# Altium schematic sheet PWR_DC_DC_EXAR.SchDoc: =ProjectName
size 420 x 297 mm; Author: T.P.; CompanyName: WUT; DrawnBy: T.P.; Organization: WUT ISE; Address1: Warsaw Univeristy of Technology; Address2: Nowowiejska 15/19; DocumentNumber: 27; Revision: 0.9; SheetNumber: 27; SheetTotal: 36; EDA_Number: ARTIQ; Projet: ARTIQ/SINARA; ModifiedBy: -; CreateDate: XX/XX/XXXX; CheckedDate: -; Title2: PWR_DC_DC_EXAR.SchDoc; DivGrp: ISE; Designer: G.K. and T.P.; ModifiedDate: -; ProjectName: ADC/DAC MEZZANINE
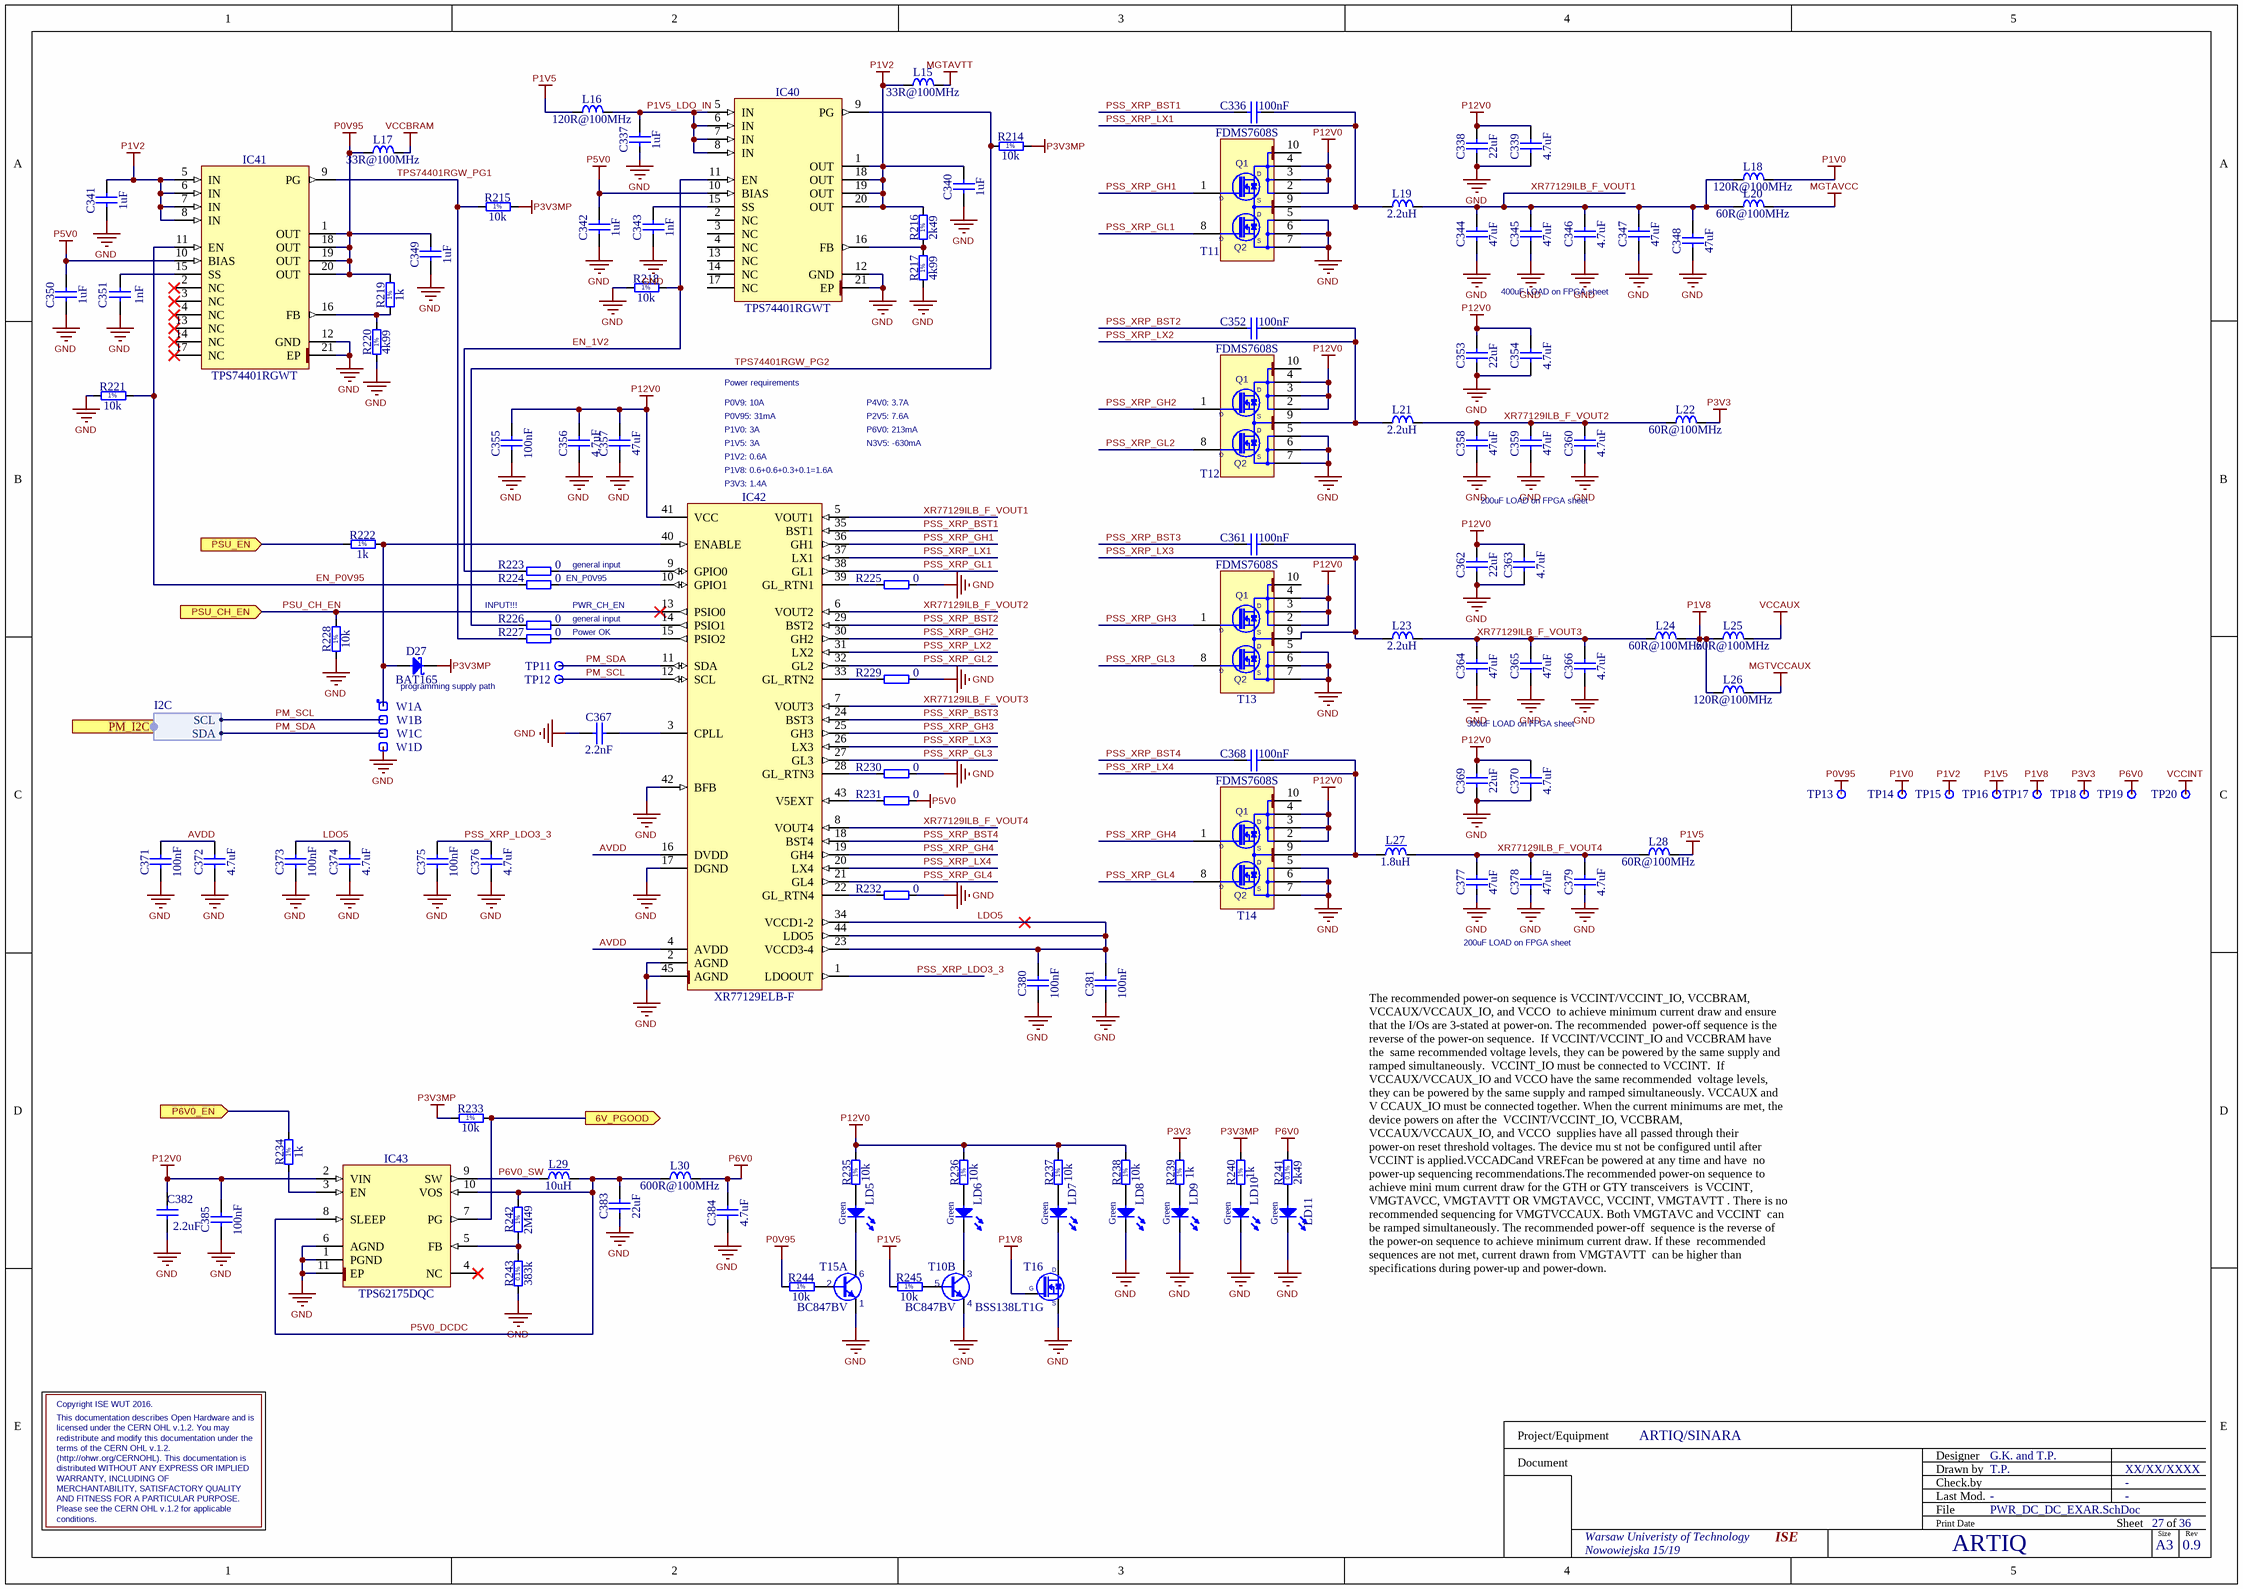
[diagram p0: PWR_DC_DC_EXAR.SchDoc]

## Parts
C336  100nF  [CAPC1005X55N]
C337  1uF  [CAPC1005X55N]
C338  22uF  [CAPC2012X135N]
C339  4.7uF  [CAPC1709X95N]
C340  1uF  [CAPC1005X55N]
C341  1uF  [CAPC1005X55N]
C342  1uF  [CAPC1005X55N]
C343  1nF  [CAPC1005X55N]
C344  47uF  [CAPC2012X140N]
C345  47uF  [CAPC2012X140N]
C346  4.7uF  [CAPC1709X95N]
C347  47uF  [CAPC2012X140N]
C348  47uF  [CAPC2012X140N]
C349  1uF  [CAPC1005X55N]
C350  1uF  [CAPC1005X55N]
C351  1nF  [CAPC1005X55N]
C352  100nF  [CAPC1005X55N]
C353  22uF  [CAPC2012X135N]
C354  4.7uF  [CAPC1709X95N]
C355  100nF  [CAPC1005X55N]
C356  4.7uF  [CAPC1709X95N]
C357  47uF  [CAPC3216X180N]
C358  47uF  [CAPC2012X140N]
C359  47uF  [CAPC2012X140N]
C360  4.7uF  [CAPC1709X95N]
C361  100nF  [CAPC1005X55N]
C362  22uF  [CAPC2012X135N]
C363  4.7uF  [CAPC1709X95N]
C364  47uF  [CAPC2012X140N]
C365  47uF  [CAPC2012X140N]
C366  4.7uF  [CAPC1709X95N]
C367  2.2nF  [CAPC1005X55N]
C368  100nF  [CAPC1005X55N]
C369  22uF  [CAPC2012X135N]
C370  4.7uF  [CAPC1709X95N]
C371  100nF  [CAPC1005X55N]
C372  4.7uF  [CAPC1709X95N]
C373  100nF  [CAPC1005X55N]
C374  4.7uF  [CAPC1709X95N]
C375  100nF  [CAPC1005X55N]
C376  4.7uF  [CAPC1709X95N]
C377  47uF  [CAPC2012X140N]
C378  47uF  [CAPC2012X140N]
C379  4.7uF  [CAPC1709X95N]
C380  100nF  [CAPC1005X55N]
C381  100nF  [CAPC1005X55N]
C382  2.2uF  [CAPC1005X55N]
C383  22uF  [CAPC2012X135N]
C384  4.7uF  [CAPC1709X95N]
C385  100nF  [CAPC1005X55N]
D27  BAT165  [SOD2512X110N]
IC40  TPS74401RGWT  [QFN65P500X500X100-21N-S325]
IC41  TPS74401RGWT  [QFN65P500X500X100-21N-S325]
IC42  XR77129ELB-F  [QFN50P700X700X80-45N-S520]
IC43  TPS62175DQC  [SON50P200X300X80-11N-R94X250]
L15  33R@100MHz  [INDC1608X95N]
L16  120R@100MHz  [INDC1608X95N]
L17  33R@100MHz  [INDC1608X95N]
L18  120R@100MHz  [INDC1608X95N]
L19  2.2uH  [IND_BOURNS_SRP6540]
L20  60R@100MHz  [INDC4516X180N]
L21  2.2uH  [IND_BOURNS_SRP6540]
L22  60R@100MHz  [INDC4516X180N]
L23  2.2uH  [IND_BOURNS_SRP6540]
L24  60R@100MHz  [INDC4516X180N]
L25  60R@100MHz  [INDC4516X180N]
L26  120R@100MHz  [INDC1608X95N]
L27  1.8uH  [IND_COILCRAFT_XAL7070]
L28  60R@100MHz  [INDC4516X180N]
L29  10uH  [IND_WURTH_WE-SPC-4838]
L30  600R@100MHz  [INDC2012X110N]
LD5  Green  [LED_OSRAM_LGL29K]
LD6  Green  [LED_OSRAM_LGL29K]
LD7  Green  [LED_OSRAM_LGL29K]
LD8  Green  [LED_OSRAM_LGL29K]
LD9  Green  [LED_OSRAM_LGL29K]
LD10  Green  [LED_OSRAM_LGL29K]
LD11  Green  [LED_OSRAM_LGL29K]
R214  10k  [RESC1005X40N]
R215  10k  [RESC1005X40N]
R216  2k49  [RESC1608X55N]
R217  4k99  [RESC1608X55N]
R218  10k  [RESC1005X40N]
R219  1k  [RESC1005X40N]
R220  4k99  [RESC1608X55N]
R221  10k  [RESC1005X40N]
R222  1k  [RESC1005X40N]
R223  0  [RESC1005X40N]
R224  0  [RESC1005X40N]
R225  0  [RESC1005X40N]
R226  0  [RESC1005X40N]
R227  0  [RESC1005X40N]
R228  10k  [RESC1005X40N]
R229  0  [RESC1005X40N]
R230  0  [RESC1005X40N]
R231  0  [RESC1005X40N]
R232  0  [RESC1005X40N]
R233  10k  [RESC1005X40N]
R234  1k  [RESC1005X40N]
R235  10k  [RESC1005X40N]
R236  10k  [RESC1005X40N]
R237  10k  [RESC1005X40N]
R238  10k  [RESC1005X40N]
R239  1k  [RESC1005X40N]
R240  1k  [RESC1005X40N]
R241  2k49  [RESC1608X55N]
R242  2M49  [RESC1608X55N]
R243  383k  [RESC1608X55N]
R244  10k  [RESC1005X40N]
R245  10k  [RESC1005X40N]
T10  BC847BV  [SOTFL50P160X60-6N]  (part B of 2)
T11  FDMS7608S  [FAIRCHILD_MLP08P]
T12  FDMS7608S  [FAIRCHILD_MLP08P]
T13  FDMS7608S  [FAIRCHILD_MLP08P]
T14  FDMS7608S  [FAIRCHILD_MLP08P]
T15  BC847BV  [SOTFL50P160X60-6N]  (part A of 2)
T16  BSS138LT1G  [SOT95P240X110-3N]
TP11  Test Point  [TPS127]  (value not drawn)
TP12  Test Point  [TPS127]  (value not drawn)
TP13  Test Point  [TPS127]  (value not drawn)
TP14  Test Point  [TPS127]  (value not drawn)
TP15  Test Point  [TPS127]  (value not drawn)
TP16  Test Point  [TPS127]  (value not drawn)
TP17  Test Point  [TPS127]  (value not drawn)
TP18  Test Point  [TPS127]  (value not drawn)
TP19  Test Point  [TPS127]  (value not drawn)
TP20  Test Point  [TPS127]  (value not drawn)
W1  Header 4  [SAMTEC_MTLW-104-07-L-S-250]  (value not drawn)  (parts A,B,C,D of 4)

## Ports
6V_PGOOD (out), P6V0_EN (in), PM_I2C (harness I2C), PSU_CH_EN (in), PSU_EN (in)

## Harnesses
I2C: SCL, SDA

## Nets
GND: C337.1 C338.1 C339.1 C340.1 C341.1 C342.1 C343.1 C344.1 C345.1 C346.1 C347.1 C348.1 C349.1 C350.1 C351.2 C353.1 C354.1 C355.1 C356.1 C357.1 C358.1 C359.1 C360.1 C362.1 C363.1 C364.1 C365.1 C366.1 C367.1 C369.1 C370.1 C371.1 C372.1 C373.1 C374.1 C375.1 C376.1 C377.1 C378.1 C379.1 C380.1 C381.1 C382.1 C383.1 C384.1 C385.1 IC40.12(GND) IC40.21(EP) IC41.12(GND) IC41.21(EP) IC42.2(AGND) IC42.17(DGND) IC42.42(BFB) IC42.45(AGND) IC43.1(PGND) IC43.6(AGND) IC43.11(EP) LD8.1(C) LD9.1(C) LD10.1(C) LD11.1(C) R217.1 R218.1 R220.1 R221.1 R225.2 R228.1 R229.2 R230.2 R232.2 R243.1 T10.4(E) T11.5(S2) T11.6(S2) T11.7(S2) T12.5(S2) T12.6(S2) T12.7(S2) T13.5(S2) T13.6(S2) T13.7(S2) T14.5(S2) T14.6(S2) T14.7(S2) T15.1(E) T16.2(S) W1.4
MGTAVCC: L20.2
MGTAVTT: L15.2
MGTVCCAUX: L26.1
P0V95: C349.2 IC41.1(OUT) IC41.18(OUT) IC41.19(OUT) IC41.20(OUT) L17.1 R219.2 R244.1 TP13.1
P1V0: L18.1 TP14.1
P1V2: C340.2 C341.2 IC40.1(OUT) IC40.18(OUT) IC40.19(OUT) IC40.20(OUT) IC41.5(IN) IC41.6(IN) IC41.7(IN) IC41.8(IN) L15.1 R216.2 TP15.1
P1V5: L16.2 L28.2 R245.1 TP16.1
P1V8: L24.2 L25.1 L26.2 T16.1(G) TP17.1
P3V3: L22.2 R239.2 TP18.1
P3V3MP: D27.1(C) R214.2 R215.2 R233.1 R240.2
P5V0: C342.2 C350.2 IC40.10(BIAS) IC41.10(BIAS) R231.2
P6V0: C384.2 L30.2 R241.2 TP19.1
P12V0: C338.2 C339.2 C353.2 C354.2 C355.2 C356.2 C357.2 C362.2 C363.2 C369.2 C370.2 C382.2 C385.2 IC42.41(VCC) IC43.2(VIN) R235.2 R236.2 R237.2 R238.2 T11.2(D1) T11.3(D1) T11.4(D1) T12.2(D1) T12.3(D1) T12.4(D1) T13.2(D1) T13.3(D1) T13.4(D1) T14.2(D1) T14.3(D1) T14.4(D1)
VCCAUX: L25.2
VCCBRAM: L17.2
VCCINT: TP20.1
6V_PGOOD: IC43.7(PG) R233.2 ; port 6V_PGOOD
AVDD: C371.2 C372.2 IC42.4(AVDD) IC42.16(DVDD)
EN_1V2: IC40.11(EN) R218.2 R223.1
EN_P0V95: IC41.11(EN) R221.2 R224.1
LDO5: C373.2 C374.2 C380.2 C381.2 IC42.23(VCCD3-4) IC42.34(VCCD1-2) IC42.44(LDO5)
P1V5_LDO_IN: C337.2 IC40.5(IN) IC40.6(IN) IC40.7(IN) IC40.8(IN) L16.1
P5V0_DCDC: C383.2 IC43.8(SLEEP) IC43.10(VOS) L29.2 L30.1 R242.2
P6V0_EN: R234.2 ; port P6V0_EN
P6V0_SW: IC43.9(SW) L29.1
PM_SCL: IC42.12(SCL) TP12.1 W1.2 ; port PM_I2C.SCL
PM_SDA: IC42.11(SDA) TP11.1 W1.3 ; port PM_I2C.SDA
PSS_XRP_BST1: C336.2 IC42.35(BST1)
PSS_XRP_BST2: C352.2 IC42.29(BST2)
PSS_XRP_BST3: C361.2 IC42.24(BST3)
PSS_XRP_BST4: C368.2 IC42.18(BST4)
PSS_XRP_GH1: IC42.36(GH1) T11.1(G1)
PSS_XRP_GH2: IC42.30(GH2) T12.1(G1)
PSS_XRP_GH3: IC42.25(GH3) T13.1(G1)
PSS_XRP_GH4: IC42.19(GH4) T14.1(G1)
PSS_XRP_GL1: IC42.38(GL1) T11.8(G2)
PSS_XRP_GL2: IC42.32(GL2) T12.8(G2)
PSS_XRP_GL3: IC42.27(GL3) T13.8(G2)
PSS_XRP_GL4: IC42.21(GL4) T14.8(G2)
PSS_XRP_LDO3_3: C375.2 C376.2 IC42.1(LDOOUT)
PSS_XRP_LX1: C336.1 IC42.37(LX1) L19.1 T11.9(S1D2)
PSS_XRP_LX2: C352.1 IC42.31(LX2) L21.1 T12.9(S1D2)
PSS_XRP_LX3: C361.1 IC42.26(LX3) L23.1 T13.9(S1D2)
PSS_XRP_LX4: C368.1 IC42.20(LX4) L27.1 T14.9(S1D2)
PSU_CH_EN: IC42.13(PSIO0) R228.2 ; port PSU_CH_EN
PSU_EN: R222.2 ; port PSU_EN
TPS74401RGW_PG1: IC41.9(PG) R215.1 R227.1
TPS74401RGW_PG2: IC40.9(PG) R214.1 R226.1
XR77129ILB_F_VOUT1: C344.2 C345.2 C346.2 C347.2 C348.2 IC42.5(VOUT1) L18.2 L19.2 L20.1
XR77129ILB_F_VOUT2: C358.2 C359.2 C360.2 IC42.6(VOUT2) L21.2 L22.1
XR77129ILB_F_VOUT3: C364.2 C365.2 C366.2 IC42.7(VOUT3) L23.2 L24.1
XR77129ILB_F_VOUT4: C377.2 C378.2 C379.2 IC42.8(VOUT4) L27.2 L28.1
NetC343_2: C343.2 IC40.15(SS)
NetC351_1: C351.1 IC41.15(SS)
NetC367_2: C367.2 IC42.3(CPLL)
NetD27_2: D27.2(A) IC42.40(ENABLE) R222.1 W1.1
NetIC40_16: IC40.16(FB) R216.1 R217.2
NetIC41_16: IC41.16(FB) R219.1 R220.2
NetIC42_9: IC42.9(GPIO0) R223.2
NetIC42_10: IC42.10(GPIO1) R224.2
NetIC42_14: IC42.14(PSIO1) R226.2
NetIC42_15: IC42.15(PSIO2) R227.2
NetIC42_22: IC42.22(GL_RTN4) R232.1
NetIC42_28: IC42.28(GL_RTN3) R230.1
NetIC42_33: IC42.33(GL_RTN2) R229.1
NetIC42_39: IC42.39(GL_RTN1) R225.1
NetIC42_43: IC42.43(V5EXT) R231.1
NetIC43_3: IC43.3(EN) R234.1
NetIC43_5: IC43.5(FB) R242.1 R243.2
NetLD5_1: LD5.1(C) T15.6(C)
NetLD5_2: LD5.2(A) R235.1
NetLD6_1: LD6.1(C) T10.3(C)
NetLD6_2: LD6.2(A) R236.1
NetLD7_1: LD7.1(C) T16.3(D)
NetLD7_2: LD7.2(A) R237.1
NetLD8_2: LD8.2(A) R238.1
NetLD9_2: LD9.2(A) R239.1
NetLD10_2: LD10.2(A) R240.1
NetLD11_2: LD11.2(A) R241.1
NetR244_2: R244.2 T15.2(B)
NetR245_2: R245.2 T10.5(B)

Not connected (* = marked no-connect by the designer): IC40 2(NC) 3(NC) 4(NC) 13(NC) 14(NC) 17(NC); IC41 2(NC)* 3(NC)* 4(NC)* 13(NC)* 14(NC)* 17(NC)*; IC43 4(NC)*; T11 10(D1); T12 10(D1); T13 10(D1); T14 10(D1)

## Notes on the sheet
- 400uF LOAD on FPGA sheet
- Power requirements
- P1V0: 3A
- P0V95: 31mA
- P1V5: 3A
- P0V9: 10A
- P1V2: 0.6A
- P4V0: 3.7A
- P2V5: 7.6A
- P6V0: 213mA
- N3V5: -630mA
- (near IC42) P3V3: 1.4A
- (near IC42) P1V8: 0.6+0.6+0.3+0.1=1.6A
- 200uF LOAD on FPGA sheet
- EN_P0V95
- general input
- INPUT!!!
- Power OK
- PWR_CH_EN
- programming supply path
- 300uF LOAD on FPGA sheet
- The recommended power-on sequence is VCCINT/VCCINT_IO, VCCBRAM, VCCAUX/VCCAUX_IO, and VCCO  to achieve minimum current draw and ensure that the I/Os are 3-stated at power-on. The recommended  power-off sequence is the reverse of the power-on sequence.  If VCCINT/VCCINT_IO and VCCBRAM have the  same recommended voltage levels, they can be powered by the same supply and ramped simultaneously.  VCCINT_IO must be connected to VCCINT.  If VCCAUX/VCCAUX_IO and VCCO have the same recommended  voltage levels, they can be powered by the same supply and ramped simultaneously. VCCAUX and V CCAUX_IO must be connected together. When the current minimums are met, the device powers on after the  VCCINT/VCCINT_IO, VCCBRAM, VCCAUX/VCCAUX_IO, and VCCO  supplies have all passed through their power-on reset threshold voltages. The device mu st not be configured until after VCCINT is applied.VCCADCand VREFcan be powered at any time and have  no power-up sequencing recommendations.The recommended power-on sequence to achieve mini mum current draw for the GTH or GTY transceivers  is VCCINT, VMGTAVCC, VMGTAVTT OR VMGTAVCC, VCCINT, VMGTAVTT . There is no recommended sequencing for VMGTVCCAUX. Both VMGTAVC and VCCINT  can be ramped simultaneously. The recommended power-off  sequence is the reverse of the power-on sequence to achieve minimum current draw. If these  recommended sequences are not met, current drawn from VMGTAVTT  can be higher than specifications during power-up and power-down.
- This documentation describes Open Hardware and is
- Copyright ISE WUT 2016.
- redistribute and modify this documentation under the
- terms of the CERN OHL v.1.2.
- distributed WITHOUT ANY EXPRESS OR IMPLIED
- licensed under the CERN OHL v.1.2. You may
- MERCHANTABILITY, SATISFACTORY QUALITY
- (http://ohwr.org/CERNOHL). This documentation is
- WARRANTY, INCLUDING OF
- Please see the CERN OHL v.1.2 for applicable
- conditions.
- AND FITNESS FOR A PARTICULAR PURPOSE.
- Project/Equipment
- Document
- Designer
- Drawn by
- Check.by
- File
- Last Mod.
- Print Date
- Sheet
- Size
- A3
- of
- Rev
- (in symbol FDMS7608S) D; Q1; G; S; Q2
- (in symbol R0402_1K_1%_0.0625W_100PPM) 1%
- (in symbol R0402_10K_1%_0.0625W_100PPM) 1%
- (in symbol R0603_2K49_0.1%_0.063W_10PPM) 0.1%
- (in symbol R0603_2K49_1%_0.063W_50PPM) 1%
- (in symbol R0603_2M49_1%_0.1W_100PPM) 1%
- (in symbol R0603_4K99_1%_0.063W_50PPM) 1%
- (in symbol R0603_383K_0.1%_0.063W_25PPM) 0.1%

## Library data of the parts
C336 C352 C355 C361 C368 C371 C373 C375 C380 C381 C385 = CC0402_100NF_16V_10%_X5R: Non-polarised capacitor; Manufacturer: GENERIC; Part Description: SMD Multilayer Chip Ceramic Capacitor; Manufacturer1 Part Number: GRM155R61C104KA88D; Tolerance: ±10%; Voltage: 16V; TC: X5R; Manufacturer Part Number: CC0402_100NF_16V_10%_X5R; Part Number: CC0402_100NF_16V_10%_X5R; Value: 100nF; Component Kind: Standard; Component Type: Standard; Pin Count: 2; Status: None; Case: 0402; Mounted: Yes; Socket: No; SMD: Yes; Sense: No; Manufacturer1 Example: MURATA; Manufacturer1 ComponentHeight: 0.55mm; HelpURL: \\cern.ch\dfs\Applications\Altium\Datasheets\CC0402_X5R_MURATA_GRM.pdf; Author: CERN DEM JLC; CreateDate: 10.12.2013; LatestRevisionDate: 10.12.2013
C337 C340-C342 C349 C350 = CC0402_1UF_16V_10%_X5R: Non-polarised capacitor; Manufacturer: GENERIC; Part Description: SMD Multilayer Chip Ceramic Capacitor; Manufacturer1 Part Number: C1005X5R1C105KT; Tolerance: ±10%; Voltage: 16V; TC: X5R; Manufacturer Part Number: CC0402_1UF_16V_10%_X5R; Part Number: CC0402_1UF_16V_10%_X5R; Value: 1uF; Component Kind: Standard; Component Type: Standard; Pin Count: 2; Status: Preferred; Case: 0402; Mounted: Yes; Socket: No; SMD: Yes; Sense: No; Manufacturer1 Example: TDK; Manufacturer1 ComponentHeight: 0.55mm; HelpURL: \\cern.ch\dfs\Applications\Altium\Datasheets\CC0402_X5R_TDK_C.pdf; Author: CERN DEM JLC; CreateDate: 25.10.2012; LatestRevisionDate: 25.10.2012
C338 C353 C362 C369 C383 = CC0805_22UF_16V_10%_X5R: Non-polarised capacitor; Manufacturer: GENERIC; Part Description: SMD Multilayer Chip Ceramic Capacitor; Manufacturer1 Part Number: C2012X5R1C226KT; Tolerance: ±10%; Voltage: 16V; TC: X5R; Manufacturer Part Number: CC0805_22UF_16V_10%_X5R; Part Number: CC0805_22UF_16V_10%_X5R; Value: 22uF; Component Kind: Standard; Component Type: Standard; Pin Count: 2; Status: Preferred; Case: 0805; Mounted: Yes; Socket: No; SMD: Yes; Sense: No; Manufacturer1 Example: TDK; Manufacturer1 ComponentHeight: 1.35mm; HelpURL: \\cern.ch\dfs\Applications\Altium\Datasheets\CC0805_X5R_TDK_C.pdf; Author: CERN DEM JLC; CreateDate: 25.10.2012; LatestRevisionDate: 25.10.2012
C339 C346 C354 C356 C360 C363 C366 C370 C372 C374 C376 C379 C384 = CC0603_4.7UF_16V_10%_X5R: Non-polarised capacitor; Manufacturer: GENERIC; Part Description: SMD Multilayer Chip Ceramic Capacitor; Manufacturer1 Part Number: EMK107ABJ475KA-T; Tolerance: ±10%; Voltage: 16V; TC: X5R; Manufacturer Part Number: CC0603_4.7UF_16V_10%_X5R; Part Number: CC0603_4.7UF_16V_10%_X5R; Value: 4.7uF; Component Kind: Standard; Component Type: Standard; Pin Count: 2; Status: None; Case: 0603; Mounted: Yes; Socket: No; SMD: Yes; Sense: No; Manufacturer1 Example: TAIYO YUDEN; Manufacturer1 ComponentHeight: 0.95mm; HelpURL: \\cern.ch\dfs\Applications\Altium\Datasheets\CC0603_X7R_TAIYO-YUDEN_HIGH-VALUE.pdf; Author: CERN DEM JLC; CreateDate: 16.12.2013; LatestRevisionDate: 16.09.2014
C343 C351 = CC0402_1NF_50V_10%_X7R: Non-polarised capacitor; Manufacturer: GENERIC; Manufacturer1 Part Number: 223858715623; Part Description: SMD Multilayer Chip Ceramic Capacitor; TC: X7R; Tolerance: ±10%; Voltage: 50V; Author: CERN DEM JLC; Case: 0402; Component Kind: Standard; Component Type: Standard; CreateDate: 03.12.2007; HelpURL: \\cern.ch\dfs\Applications\Altium\Datasheets\CC0402_X7R_PHYCOMP.pdf; LatestRevisionDate: 03.12.2007; Manufacturer Part Number: CC0402_1NF_50V_10%_X7R; Manufacturer1 ComponentHeight: 0.55mm; Manufacturer1 Example: PHYCOMP; Mounted: Yes; Part Number: CC0402_1NF_50V_10%_X7R; Pin Count: 2; SMD: Yes; Socket: No; Status: Not Recommended; Value: 1nF; Sense: No
C344 C345 C347 C348 C358 C359 C364 C365 C377 C378 = CC0805_47UF_6.3V_20%_X5R: Non-polarised capacitor; Manufacturer: GENERIC; Part Description: SMD Multilayer Chip Ceramic Capacitor; Manufacturer1 Part Number: C0805C476M9PACTU; Tolerance: ±20%; Voltage: 6.3V; TC: X5R; Manufacturer Part Number: CC0805_47UF_6.3V_20%_X5R; Part Number: CC0805_47UF_6.3V_20%_X5R; Value: 47uF; Component Kind: Standard; Component Type: Standard; Pin Count: 2; Status: Preferred; Case: 0805; Mounted: Yes; Socket: No; SMD: Yes; Sense: No; Manufacturer1 Example: KEMET; Manufacturer1 ComponentHeight: 1.4mm; HelpURL: \\cern.ch\dfs\Applications\Altium\Datasheets\CC0805_X5R_KEMET.pdf; Author: CERN DEM JLC; CreateDate: 16.10.2012; LatestRevisionDate: 16.10.2012
C357 = CC1206_47UF_25V_20%_X5R: Non-polarised capacitor; Manufacturer: GENERIC; Part Description: SMD Multilayer Chip Ceramic Capacitor; Manufacturer1 Part Number: C3216X5R1E476M160AC; Tolerance: ±20%; Voltage: 25V; TC: X5R; Manufacturer Part Number: CC1206_47UF_25V_20%_X5R; Part Number: CC1206_47UF_25V_20%_X5R; Value: 47uF; Component Kind: Standard; Component Type: Standard; Pin Count: 2; Status: None; Case: 1206; Mounted: Yes; Socket: No; SMD: Yes; Sense: No; Manufacturer1 Example: TDK; Manufacturer1 ComponentHeight: 1.8mm; HelpURL: \\cern.ch\dfs\Applications\Altium\Datasheets\CC1206_X5R_TDK_C.pdf; Author: CERN DEM JLC; CreateDate: 20.11.2013; LatestRevisionDate: 14.03.2017
C367 = CC0402_2.2NF_50V_10%_X7R: Non-polarised capacitor; Manufacturer: GENERIC; Part Description: SMD Multilayer Chip Ceramic Capacitor; Manufacturer1 Part Number: 223858715627; Tolerance: ±10%; Voltage: 50V; TC: X7R; Manufacturer Part Number: CC0402_2.2NF_50V_10%_X7R; Part Number: CC0402_2.2NF_50V_10%_X7R; Value: 2.2nF; Component Kind: Standard; Component Type: Standard; Pin Count: 2; Status: Not Recommended; Case: 0402; Mounted: Yes; Socket: No; SMD: Yes; Sense: No; Manufacturer1 Example: PHYCOMP; Manufacturer1 ComponentHeight: 0.55mm; HelpURL: \\cern.ch\dfs\Applications\Altium\Datasheets\CC0402_X7R_PHYCOMP.pdf; Author: CERN DEM JLC; CreateDate: 03.12.2007; LatestRevisionDate: 03.12.2007
C382 = CC0402_2.2UF_6.3V_10%_X5R: Non-polarised capacitor; Part Description: SMD Multilayer Chip Ceramic Capacitor; Manufacturer: GENERIC; Manufacturer1 Part Number: C1005X5R0J225K050BC; Voltage: 6.3V; TC: X5R; Tolerance: ±10%; Part Number: CC0402_2.2UF_6.3V_10%_X5R; Component Kind: Standard; Component Type: Standard; Pin Count: 2; Value: 2.2uF; Status: Preferred; Manufacturer Part Number: CC0402_2.2UF_6.3V_10%_X5R; Case: 0402; Mounted: Yes; Socket: No; SMD: Yes; Sense: No; Manufacturer1 Example: TDK; Manufacturer1 ComponentHeight: 0.55mm; HelpURL: \\cern.ch\dfs\Applications\Altium\Datasheets\CC0402_X5R_TDK_C.pdf; Author: CERN DEM JMW; CreateDate: 22.09.2015; LatestRevisionDate: 22.09.2015
D27 = BAT165: Schottky Diode; Manufacturer: INFINEON; Part Description: Medium Power AF Schottky Diode; Voltage: 40V; Power: 750mA; PressFit: No; Bonding: No; Manufacturer Part Number: BAT165; PackageDescription: Small Outline Diode (SOD-323), 1.70mm W X 1.25mm L X 1.10mm H body,  IPC Medium Density; Part Number: BAT165; Component Kind: Standard; Component Type: Standard; Device: BAT165; Pin Count: 2; Case: SOD323; Mounted: Yes; Socket: No; SMD: Yes; Sense: No; ComponentHeight: 1.1mm; HelpURL: \\cern.ch\dfs\Applications\Altium\Datasheets\BAT165.pdf; Author: CERN DEM JLC; CreateDate: 12.11.2014; LatestRevisionDate: 12.11.2014
IC40 IC41 = TPS74401RGWT: Single Output LDO, 3.0A, Adj.(0.8 to 3.3V), Fast Transient Response, Programmable SoftStart; Manufacturer: TEXAS INSTRUMENTS; PressFit: No; Bonding: No; Manufacturer Part Number: TPS74401RGWT; PackageDescription: QFN, 0.65mm pitch,square; 20 pin, 5mm X 5mm X 1mm H body (w/thermal tab 3.25 X 3.25mm),  IPC Medium Density; Part Description: Single Output LDO, 3.0A, Adj.(0.8 to 3.3V), Fast Transient Response, Programmable SoftStart; Part Number: TPS74401RGWT; Component Kind: Standard; Component Type: Standard; Device: TPS74401RGWT; Pin Count: 21; Case: QFN20; Mounted: Yes; Socket: No; SMD: Yes; Sense: No; ComponentHeight: 1mm; HelpURL: \\cern.ch\dfs\Applications\Altium\Datasheets\TPS74401RGWT.pdf; Author: CERN DEM JLC; CreateDate: 02.02.2010; LatestRevisionDate: 02.02.2010
IC42 = XR77129ELB-F: 40V Quad Channel Digital PWM/PFM Universal PMIC; Manufacturer: EXAR; PressFit: No; Bonding: No; Manufacturer Part Number: XR77129ELB-F; Part Description: 40V Quad Channel Digital PWM/PFM Universal PMIC; Part Number: XR77129ELB-F; Component Kind: Standard; Component Type: Standard; Device: XR77129ELB-F; PackageDescription: 50mm Pitch, Square; 44 Pin, 7.00mm L X 7.00mm W X 0.80mm H Body (W/Thermal Tab 5.2mm X 5.2mm), IPC Medium Density; Pin Count: 45; Case: QFN44; Mounted: Yes; Socket: No; SMD: Yes; Sense: No; ComponentHeight: 0.8mm; HelpURL: \\cern.ch\dfs\Applications\Altium\Datasheets\XR77129ELB-F.pdf; Author: CERN DEM JLC; CreateDate: 04.07.2017; LatestRevisionDate: 04.07.2017
IC43 = TPS62175DQC: 4.75-28VDC to 1-6VDC, 500mA Step-Down Converter With Sleep Mode; Manufacturer: TEXAS INSTRUMENTS; PressFit: No; Bonding: No; Manufacturer Part Number: TPS62175DQC; PackageDescription: SON, 10-Leads, Body 2x3mm, Pitch 0.5mm, Thermal Pad 0.94x2.5mm, IPC Medium Density; Part Description: 4.75-28VDC to 1-6VDC, 500mA Step-Down Converter With Sleep Mode; Part Number: TPS62175DQC; Component Kind: Standard; Component Type: Standard; Device: TPS62175DQC; Pin Count: 11; Case: SON10; Mounted: Yes; Socket: No; SMD: Yes; Sense: No; ComponentHeight: 0.8mm; HelpURL: \\cern.ch\dfs\Applications\Altium\Datasheets\TPS62175DQC.pdf; Author: CERN DEM JMW; CreateDate: 11.08.2015; LatestRevisionDate: 11.08.2015
L15 L17 = IND0603_MURATA_BLM18PG330SN1D: Inductor; Manufacturer: MURATA; Part Description: SMD EMIFIL Chip Ferrite Bead; Tolerance: ±25%; Power: 3A; Resistance: 0.025R; Manufacturer Part Number: BLM18PG330SN1D; Part Number: IND0603_MURATA_BLM18PG330SN1D; Value: 33R@100MHz; Component Kind: Standard; Component Type: Standard; Pin Count: 2; Status: None; Case: 0603; Mounted: Yes; Socket: No; SMD: Yes; Sense: No; ComponentHeight: 0.95mm; HelpURL: \\cern.ch\dfs\Applications\Altium\Datasheets\IND0603_MURATA_BLM18P.pdf; Author: CERN DEM JMW; CreateDate: 19.02.2014; LatestRevisionDate: 19.02.2014
L16 L18 L26 = IND0603_MURATA_BLM18PG121SN1D: Inductor; Manufacturer: MURATA; Part Description: SMD EMIFIL Chip Ferrite Bead; Power: 2A; Resistance: 0.05R; Manufacturer Part Number: BLM18PG121SN1D; Part Number: IND0603_MURATA_BLM18PG121SN1D; Value: 120R@100MHz; Component Kind: Standard; Component Type: Standard; Pin Count: 2; Status: None; Case: 0603; Mounted: Yes; Socket: No; SMD: Yes; Sense: No; ComponentHeight: 0.95mm; HelpURL: \\cern.ch\dfs\Applications\Altium\Datasheets\IND0603_MURATA_BLM18P.pdf; Author: CERN DEM BC; CreateDate: 27.07.2015; LatestRevisionDate: 27.07.2015
L19 L21 L23 = IND_2.2UH_20%_BOURNS_SRP6540: Inductor; Manufacturer Part Number: SRP6540-2R2M; Manufacturer: BOURNS; Part Description: Shielded SMD Power Inductor; Tolerance: ±20%; Power: 9A; Resistance: 0.0155R; Part Number: IND_2.2UH_20%_BOURNS_SRP6540; Value: 2.2uH; Component Kind: Standard; Component Type: Standard; Pin Count: 2; Status: None; Mounted: Yes; Socket: No; SMD: Yes; Sense: No; ComponentHeight: 4mm; HelpURL: \\cern.ch\dfs\Applications\Altium\Datasheets\IND_BOURNS_SRP6540.pdf; Author: CERN DEM JMW; CreateDate: 06.08.2015; LatestRevisionDate: 06.08.2015
L20 L22 L24 L25 L28 = IND1806_MURATA_BLM41PG600SN1L: Inductor; Manufacturer: MURATA; Part Description: SMD EMI Suppression Chip Ferrite Bead (BLM41P Series); Power: 6A; Resistance: 0.01R; Manufacturer Part Number: BLM41PG600SN1L; Part Number: IND1806_MURATA_BLM41PG600SN1L; Value: 60R@100MHz; Component Kind: Standard; Component Type: Standard; Pin Count: 2; Status: None; Case: 1806; Mounted: Yes; Socket: No; SMD: Yes; Sense: No; ComponentHeight: 1.8mm; HelpURL: \\cern.ch\dfs\Applications\Altium\Datasheets\IND1806_MURATA_BLM41P.pdf; Author: CERN DEM JLC; CreateDate: 02.12.2009; LatestRevisionDate: 02.12.2009
L27 = IND_1.8UH_20%_COILCRAFT_XAL7070: Inductor With Core; Manufacturer Part Number: XAL7070-182MEC; Part Description: SMD Shielded Power Inductor; Tolerance: ±20%; Power: 15.8A; Resistance: 0.00405R; Manufacturer: COILCRAFT; Part Number: IND_1.8UH_20%_COILCRAFT_XAL7070; Value: 1.8uH; Component Kind: Standard; Component Type: Standard; Pin Count: 2; Status: None; Mounted: Yes; Socket: No; SMD: Yes; Sense: No; ComponentHeight: 7mm; HelpURL: \\cern.ch\dfs\Applications\Altium\Datasheets\IND_COILCRAFT_XAL7070.pdf; Author: CERN DEM JLC; CreateDate: 03.11.2016; LatestRevisionDate: 03.11.2016
L29 = IND_10UH_20%_WURTH_WE-SPC_74408943100: Inductor With Core; Part Description: SMD Shielded Power Inductor (WE-SPC Series); Manufacturer: WURTH ELEKTRONIK; Power: 1.65A; Resistance: 0.082R; Tolerance: ±20%; Part Number: IND_10UH_20%_WURTH_WE-SPC_74408943100; Component Kind: Standard; Component Type: Standard; Pin Count: 2; Value: 10uH; Status: None; Manufacturer Part Number: 74408943100; Mounted: Yes; Socket: No; SMD: Yes; Sense: No; ComponentHeight: 4.1mm; HelpURL: \\cern.ch\dfs\Applications\Altium\Datasheets\IND_WURTH_WE-SPC_74408943100.pdf; Author: CERN DEM MR; CreateDate: 30.06.2017; LatestRevisionDate: 05.07.2017
L30 = IND0805_WURTH_742792040: Inductor; Manufacturer: WURTH ELEKTRONIK; Part Description: SMD EMI Suppression Chip Ferrite Bead (WE-CBF Series); Tolerance: ±25%; Power: 2A; Resistance: 0.150R; Manufacturer Part Number: 742792040; Part Number: IND0805_WURTH_742792040; Value: 600R@100MHz; Component Kind: Standard; Component Type: Standard; Pin Count: 2; Status: None; Case: 0805; Mounted: Yes; Socket: No; SMD: Yes; Sense: No; ComponentHeight: 1.1mm; HelpURL: \\cern.ch\dfs\Applications\Altium\Datasheets\IND0805_WURTH_742792040.pdf; Author: CERN DEM JLC; CreateDate: 10.05.2010; LatestRevisionDate: 10.05.2010
LD5-LD11 = LED_OSRAM_LG L29K-G2J1-24-Z: LED Green 1C 2A; Manufacturer: OSRAM; Part Description: Surface Mount Green LED (0603 Case); Bonding: No; PressFit: No; Status Comment: Sourcing Difficulty; Author: CERN DEM JLC; Case: 0603; Color: Green; Component Kind: Standard; Component Type: Standard; ComponentHeight: 0.67mm; CreateDate: 24.04.2012; HelpURL: \\cern.ch\dfs\Applications\Altium\Datasheets\LED_OSRAM_LGL29K.pdf; LatestRevisionDate: 24.04.2012; Manufacturer Part Number: LG L29K-G2J1-24-Z; Mounted: Yes; PackageDescription: Green Chip LED, 2-Leads, Body 1.7x0.8mm, IPC Medium Density; Part Number: LED_OSRAM_LG L29K-G2J1-24-Z; Pin Count: 2; SMD: Yes; Socket: No; Status: Not Recommended; Sense: No
R214 R215 R218 R221 R228 R233 R235-R238 R244 R245 = R0402_10K_1%_0.0625W_100PPM: Resistor - 1%; Manufacturer: GENERIC; Part Description: General Purpose Thick Film Chip Resistor; Manufacturer1 Part Number: 232270671003L; TC: ±100ppm/°C; PressFit: No; Manufacturer Part Number: R0402_10K_1%_0.0625W_100PPM; Part Number: R0402_10K_1%_0.0625W_100PPM; Tolerance: ±1%; Value: 10k; Component Kind: Standard; Component Type: Standard; Pin Count: 2; Status: Not Recommended; Power: 0.0625W; Case: 0402; Mounted: Yes; Sense: No; Socket: No; SMD: Yes; Manufacturer1 Example: YAGEO PHYCOMP; Manufacturer1 ComponentHeight: 0.4mm; HelpURL: \\cern.ch\dfs\Applications\Altium\Datasheets\R0402_Phycomp_RC0402.pdf; Author: CERN DEM JLC; CreateDate: 03.12.2007; LatestRevisionDate: 17.10.2012
R216 = R0603_2K49_1%_0.063W_50PPM: Resistor - 1%; Manufacturer: GENERIC; Part Description: General Purpose Thick Film Chip Resistor; Manufacturer1 Part Number: CPF0603F2K49C1; Power: 0.1W; TC: ±50ppm/°C; PressFit: No; Manufacturer Part Number: R0603_2K49_1%_0.063W_50PPM; Part Number: R0603_2K49_1%_0.063W_50PPM; Tolerance: ±1%; Value: 2k49; Component Kind: Standard; Component Type: Standard; Pin Count: 2; Status: None; Case: 0603; Mounted: Yes; Sense: No; Socket: No; SMD: Yes; Manufacturer1 Example: TYCO NEOHM; Manufacturer1 ComponentHeight: 0.55mm; HelpURL: \\cern.ch\dfs\Applications\Altium\Datasheets\R0603_TYCO_CPF.pdf; Author: CERN DEM JLC; CreateDate: 20.05.2010; LatestRevisionDate: 20.05.2010
R217 R220 = R0603_4K99_1%_0.063W_50PPM: Resistor - 1%; Manufacturer: GENERIC; Part Description: General Purpose Thick Film Chip Resistor; Manufacturer1 Part Number: CPF0603F4K99C1; Power: 0.1W; TC: ±50ppm/°C; PressFit: No; Manufacturer Part Number: R0603_4K99_1%_0.063W_50PPM; Part Number: R0603_4K99_1%_0.063W_50PPM; Tolerance: ±1%; Value: 4k99; Component Kind: Standard; Component Type: Standard; Pin Count: 2; Status: None; Case: 0603; Mounted: Yes; Sense: No; Socket: No; SMD: Yes; Manufacturer1 Example: TYCO NEOHM; Manufacturer1 ComponentHeight: 0.55mm; HelpURL: \\cern.ch\dfs\Applications\Altium\Datasheets\R0603_TYCO_CPF.pdf; Author: CERN DEM JLC; CreateDate: 20.05.2010; LatestRevisionDate: 20.05.2010
R219 R222 R234 R239 R240 = R0402_1K_1%_0.0625W_100PPM: Resistor - 1%; Manufacturer: GENERIC; Part Description: General Purpose Thick Film Chip Resistor; Manufacturer1 Part Number: 232270671002L; TC: ±100ppm/°C; PressFit: No; Manufacturer Part Number: R0402_1K_1%_0.0625W_100PPM; Part Number: R0402_1K_1%_0.0625W_100PPM; Tolerance: ±1%; Value: 1k; Component Kind: Standard; Component Type: Standard; Pin Count: 2; Status: Not Recommended; Power: 0.0625W; Case: 0402; Mounted: Yes; Sense: No; Socket: No; SMD: Yes; Manufacturer1 Example: YAGEO PHYCOMP; Manufacturer1 ComponentHeight: 0.4mm; HelpURL: \\cern.ch\dfs\Applications\Altium\Datasheets\R0402_Phycomp_RC0402.pdf; Author: CERN DEM JLC; CreateDate: 03.12.2007; LatestRevisionDate: 17.10.2012
R223-R227 R229-R232 = R0402_0R_JUMPER: Resistor; Manufacturer: GENERIC; Part Description: 1A (0.05R Max DC Resistance) Zero Ohm Jumper; Manufacturer1 Part Number: 232270591001L; PressFit: No; Manufacturer Part Number: R0402_0R_JUMPER; Part Number: R0402_0R_JUMPER; Value: 0; Component Kind: Standard; Component Type: Standard; Pin Count: 2; Status: Not Recommended; Case: 0402; Mounted: Yes; Sense: No; Socket: No; SMD: Yes; Manufacturer1 Example: YAGEO PHYCOMP; Manufacturer1 ComponentHeight: 0.4mm; HelpURL: \\cern.ch\dfs\Applications\Altium\Datasheets\R0402_Phycomp_RC0402.pdf; Author: CERN DEM JLC; CreateDate: 03.12.2007; LatestRevisionDate: 17.10.2012
R241 = R0603_2K49_0.1%_0.063W_10PPM: Resistor - 0.1%; Part Description: Thin Film Chip Resistor; Manufacturer: GENERIC; Manufacturer1 Part Number: RN73C1J2K49BTDF; Power: 0.063W; TC: ±10ppm; PressFit: No; Part Number: R0603_2K49_0.1%_0.063W_10PPM; Component Kind: Standard; Component Type: Standard; Pin Count: 2; Value: 2k49; Status: Not Recommended; Tolerance: ±0.1%; Manufacturer Part Number: R0603_2K49_0.1%_0.063W_10PPM; Case: 0603; Mounted: Yes; Sense: No; Socket: No; SMD: Yes; Manufacturer1 Example: TYCO HOLSWORTHY; Manufacturer1 ComponentHeight: 0.5mm; HelpURL: \\cern.ch\dfs\Applications\Altium\Datasheets\R0603_Tyco_RN73.pdf; Author: CERN DEM JLC; CreateDate: 03.12.2007; LatestRevisionDate: 13.03.2008
R242 = R0603_2M49_1%_0.1W_100PPM: Resistor - 1%; Part Description: General Purpose Thick Film Chip Resistor; Manufacturer: GENERIC; Manufacturer1 Part Number: CRCW06032M49FKEA; Power: 0.1W; TC: ±100ppm/°C; PressFit: No; Part Number: R0603_2M49_1%_0.1W_100PPM; Component Kind: Standard; Component Type: Standard; Pin Count: 2; Value: 2M49; Status: Preferred; Tolerance: ±1%; Manufacturer Part Number: R0603_2M49_1%_0.1W_100PPM; Case: 0603; Mounted: Yes; Sense: No; Socket: No; SMD: Yes; Manufacturer1 Example: VISHAY; Manufacturer1 ComponentHeight: 0.55mm; HelpURL: \\cern.ch\dfs\Applications\Altium\Datasheets\R0603_VISHAY_CRCW e3.pdf; Author: CERN DEM JLC; CreateDate: 19.03.2014; LatestRevisionDate: 19.03.2014
R243 = R0603_383K_0.1%_0.063W_25PPM: Resistor - 0.1%; Part Description: Thin Film Chip Resistor; Manufacturer: GENERIC; Manufacturer1 Part Number: PCF0603PR-383KBT1; Power: 0.063W; TC: ±25ppm; PressFit: No; Part Number: R0603_383K_0.1%_0.063W_25PPM; Component Kind: Standard; Component Type: Standard; Pin Count: 2; Value: 383k; Status: Not Recommended; Tolerance: ±0.1%; Manufacturer Part Number: R0603_383K_0.1%_0.063W_25PPM; Case: 0603; Mounted: Yes; Sense: No; Socket: No; SMD: Yes; Manufacturer1 Example: TT ELECTRONICS; Manufacturer1 ComponentHeight: 0.55mm; HelpURL: \\cern.ch\dfs\Applications\Altium\Datasheets\R0603_TT ELECTRONICS_PCF.pdf; Author: CERN DEM JLC; CreateDate: 04.05.2010; LatestRevisionDate: 25.10.2018
T10 T15 = BC847BV: 45V, 100mA NPN General Purpose Double Transistor; Manufacturer: NXP SEMICONDUCTORS; Part Description: 45V 100mA NPN General Purpose Double Transistor; PressFit: No; Bonding: No; Manufacturer Part Number: BC847BV; PackageDescription: SOTFL (SOT666), 0.50mm, Pitch; 6 Pin, 1.20mm W X 1.60mm L X 0.60mm H Body, IPC Medium Density; Part Number: BC847BV; Component Kind: Standard; Component Type: Standard; Device: BC847BV; Pin Count: 6; Case: SOT666; Mounted: Yes; Socket: No; SMD: Yes; Sense: No; ComponentHeight: 0.6mm; HelpURL: \\cern.ch\dfs\Applications\Altium\Datasheets\BC847BV.pdf; Author: CERN DEM JLC; CreateDate: 01.12.2011; LatestRevisionDate: 01.12.2011
T11-T14 = FDMS7608S: 30V Dual N-Channel PowerTrench® MOSFET; Manufacturer: FAIRCHILD SEMICONDUCTOR; PressFit: No; Bonding: No; Manufacturer Part Number: FDMS7608S; PackageDescription: SON, 1.27mm Pitch; 8 Pin, 6.00mm W X 5.00mm L X 0.8mm H body, 2x Thermal Pad, IPC Medium Density; Part Description: 30V Dual N-Channel PowerTrench® MOSFET; Part Number: FDMS7608S; Component Kind: Standard; Component Type: Standard; Device: FDMS7608S; Pin Count: 10; Case: DFN8; Mounted: Yes; Socket: No; SMD: Yes; Sense: No; ComponentHeight: 0.8mm; HelpURL: \\cern.ch\dfs\Applications\Altium\Datasheets\FDMS7608S.pdf; Author: CERN DEM MR; CreateDate: 25.05.2016; LatestRevisionDate: 10.04.2017
T16 = BSS138LT1G: N-CHANNEL MOSFET WITH DIODE; Manufacturer: ON SEMICONDUCTOR; Part Description: 50V 200mA N-Channel Enhancement Mode Field-Effect Transistor; PressFit: No; Bonding: No; Manufacturer Part Number: BSS138LT1G; PackageDescription: SOT23 3-Leads, Pitch 0.95mm - Body 1.4x3mm, IPC Medium Density; Part Number: BSS138LT1G; Component Kind: Standard; Component Type: Standard; Device: BSS138LT1G; Pin Count: 3; Case: SOT23-3; Mounted: Yes; Socket: No; SMD: Yes; Sense: No; ComponentHeight: 1.11mm; HelpURL: \\cern.ch\dfs\Applications\Altium\Datasheets\BSS138LT1G.pdf; Author: CERN DEM JLC; CreateDate: 23.03.2009; LatestRevisionDate: 23.03.2009
TP11-TP20 = SMD_PAD_1.27X1.27MM: Part Description: 1.27mm x 1.27mm PCB Copper Area (SMD Test Point); Mounted: No; Part Number: SMD_PAD_1.27X1.27MM; Component Kind: Standard (No BOM); Component Type: Standard (No BOM); Pin Count: 1; Family: Test Point; Socket: No; SMD: Yes; Sense: No; Status: None; ComponentHeight: 0mm; HelpURL: Undefined; Author: CERN DEM JLC; CreateDate: 12.01.2008; LatestRevisionDate: 12.01.2008; PackageDescription: 1.27mm x 1.27mm PCB Copper Area (SMD Test Point)
W1 = SAMTEC_MTLW-104-07-L-S-250: 4 Mini Wire-Wrap Contact Strip Header; Manufacturer: SAMTEC; Part Description: 4 Contacts, Pitch 2.54mm, Single Row Through Mount Straight Header (Post Lead = 6.35mm, Tail Lead 3.05mm, Insulator 1.52mm); PressFit: No; Manufacturer Part Number: MTLW-104-07-L-S-250; Part Number: SAMTEC_MTLW-104-07-L-S-250; Component Kind: Standard; Component Type: Standard; Pin Count: 4; Family: Header 4; Mounted: Yes; Socket: No; Sense: No; SMD: No; Status: None; ComponentHeight: 7.87mm; HelpURL: \\cern.ch\dfs\Applications\Altium\Datasheets\SAMTEC_MTLW-104-07-L-S-250.pdf; Author: CERN DEM JLC; CreateDate: 13.12.2012; LatestRevisionDate: 13.12.2012